# EAGLE design ekomigacz (EAGLE 9.3.2)
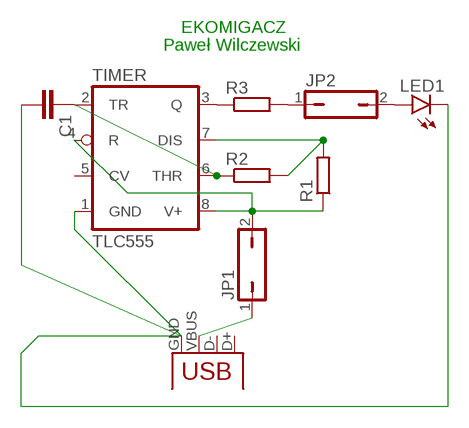
[diagram p0: schematic, sheet 1]

## Parts
C1  C5/3  [C5B3]
JP1  JP1Q  [JP1]
JP2  JP1Q  [JP1]
LED1  LED5MM  [LED5MM]
R1  R-EU_0207/10  [0207/10]
R2  R-EU_0207/10  [0207/10]
R3  R-EU_0207/10  [0207/10]
TIMER  TLC555  NE555N  [DIL08]
X1  USB-A-H  [USB-A-H]

## Nets
5V: R3.1 TIMER.3(Q)
N$1: JP1.1 X1.VBUS
N$2: R1.2 R2.2 TIMER.7(DIS)
N$4: JP1.2 R1.1 TIMER.4(R) TIMER.8(V+)
N$5: C1.1 R2.1 TIMER.2(TR) TIMER.6(THR)
N$6: JP2.1 R3.2
N$7: JP2.2 LED1.A
N$9: C1.2 LED1.K(C) TIMER.1(GND) X1.GND
Unconnected: TIMER.5(CV) X1.D+ X1.D-

## Notes on the sheet
- EKOMIGACZ
- Paweł Wilczewski

## Library data of the parts
C1 = capacitor-wima:C: CAPACITOR naming: grid - package width
JP1 JP2 = jumper:JP1Q: JUMPER
LED1 = led:LED: LED OSRAM: - CHIPLED LG R971, LG N971, LY N971, LG Q971, LY Q971, LO R971, LY R971 LH N974, LH R974 LS Q976, LO Q976, LY Q976 LO Q996 - Hyper CHIPLED LW Q18S LB Q993, LB Q99A, LB R99A - SideLED LS A670, LO A670, LY A670, LG A670, LP A670 LB A673, LV A673, LT A673, LW A673 LH A674 LY A675 LS A676, LA A676, LO A676, LY A676, LW A676 LS A679, LY A679, LG A679 - Hyper Micro SIDELED® LS Y876, LA Y876, LO Y876, LY Y876 LT Y87S - SmartLED LW L88C, LW L88S LB L89C, LB L89S, LG L890 LS L89K, LO L89K, LY L89K LS L896, LA L896, LO L896, LY L896 - TOPLED LS T670, LO T670, LY T670, LG T670, LP T670 LSG T670, LSP T670, LSY T670, LOP T670, LYG T670 LG T671, LOG T671, LSG T671 LB T673, LV T673, LT T673, LW T673 LH T674 LS T676, LA T676, LO T676, LY T676, LB T676, LH T676, LSB T676, LW T676 LB T67C, LV T67C, LT T67C, LS T67K, LO T67K, LY T67K, LW E67C LS E67B, LA E67B, LO E67B, LY E67B, LB E67C, LV E67C, LT E67C LW T67C LS T679, LY T679, LG T679 LS T770, LO T770, LY T770, LG T770, LP T770 LB T773, LV T773, LT T773, LW T773 LH T774 LS E675, LA E675, LY E675, LS T675 LS T776, LA T776, LO T776, LY T776, LB T776 LHGB T686 LT T68C, LB T68C - Hyper Mini TOPLED® LB M676 - Mini TOPLED Santana® LG M470 LS M47K, LO M47K, LY M47K Source: http://www.osram.convergy.de LUXEON: - LUMILED® LXK2-PW12-R00, LXK2-PW12-S00, LXK2-PW14-U00, LXK2-PW14-V00 LXK2-PM12-R00, LXK2-PM12-S00, LXK2-PM14-U00 LXK2-PE12-Q00, LXK2-PE12-R00, LXK2-PE12-S00, LXK2-PE14-T00, LXK2-PE14-U00 LXK2-PB12-K00, LXK2-PB12-L00, LXK2-PB12-M00, LXK2-PB14-N00, LXK2-PB14-P00, LXK2-PB14-Q00 LXK2-PR12-L00, LXK2-PR12-M00, LXK2-PR14-Q00, LXK2-PR14-R00 LXK2-PD12-Q00, LXK2-PD12-R00, LXK2-PD12-S00 LXK2-PH12-R00, LXK2-PH12-S00 LXK2-PL12-P00, LXK2-PL12-Q00, LXK2-PL12-R00 Source: www.luxeon.com KINGBRIGHT: KA-3528ASYC Source: www.kingbright.com
R1-R3 = rcl:R-EU_: RESISTOR, European symbol; SPICEPREFIX: R
TIMER = linear:*555: TIMER; SPICEPREFIX: X
X1 = con-usb:USB: USB Connectors

## Net classes
0 default: width 0.305 mm, drill 0.508 mm, clearance 0.254 mm

## Board
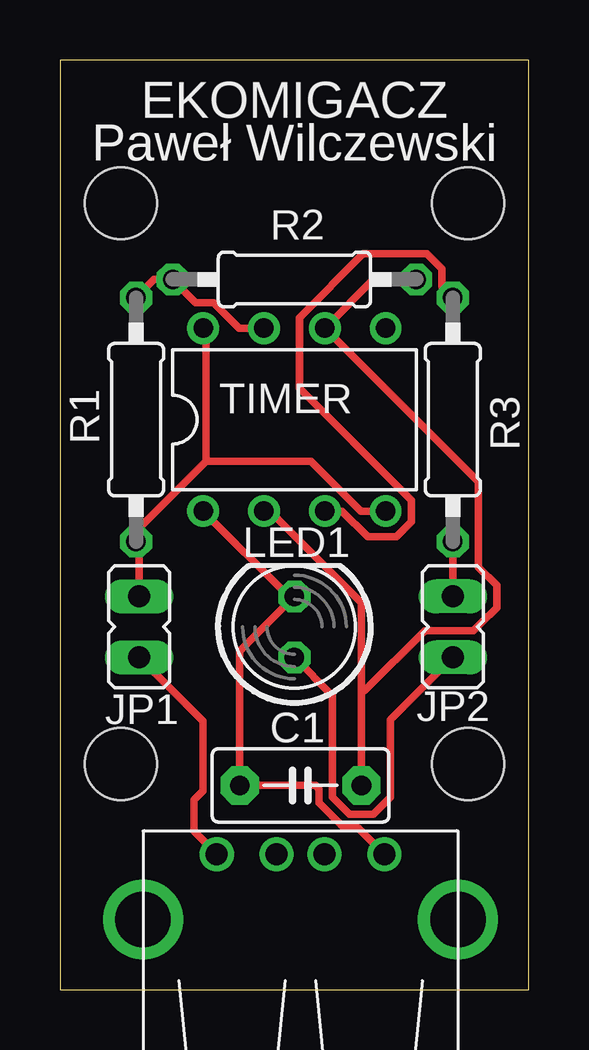
[diagram p1: board, top side]

Size 19.56 x 38.73 mm. Coordinates in mm from the lower left corner, seen from the top.
Outline: 0,0 19.56,0 19.56,38.73 0,38.73 0,0
Copper layers (1*16): Top 0.035mm / dielectric 1.5mm / Bottom 0.035mm
Design rules "default": minimum track width 6mil, minimum drill 0.35mm, track to track 6mil, track to pad 6mil, pad to pad 6mil, via to via 6mil, smd to smd 6mil, copper to edge 40mil, drill to drill 6mil, minimum pad ring 10mil, minimum via ring 8mil, stop-mask expansion 4mil, vias tented up to drill 0mil, thermal gap 10mil
Holes 3 mm at 2.54,9.4 17.02,9.4 17.02,32.77 2.54,32.77

### Footprints (pad centres in the part's own frame; a part is rotated, then mirrored left to right if it is on the bottom)
C5B3 = drill 0.813 pad 1.6 octagon: 1 -2.54,0; 2 2.54,0
JP1 = drill 0.914 long: 1 0,-1.27; 2 0,1.27
LED5MM = drill 0.813 octagon: A -1.27,0; K 1.27,0
0207/10 = drill 0.813 octagon: 1 -5.08,0; 2 5.08,0
DIL08 = drill 0.813 pad 1.27: 1 -3.81,-3.81; 2 -1.27,-3.81; 3 1.27,-3.81; 4 3.81,-3.81; 5 3.81,3.81; 6 1.27,3.81; 7 -1.27,3.81; 8 -3.81,3.81
USB-A-H = drill 0.914: D+ 2.718,-1.003; D- 2.718,1.003; GND 2.718,-3.493; VBUS 2.718,3.493 | drill 2.311: P$5 0,-6.566; P$6 0,6.566

### Placement (x,y rotation side)
C1  10.03,8.51 180 top
JP1  3.3,15.11 0 top
JP2  16.38,15.11 180 top
LED1  9.78,15.11 90 top
R1  3.17,23.75 90 top
R2  9.78,29.59 180 top
R3  16.38,23.75 270 top
TIMER  9.78,23.75 0 top
X1  10.03,2.92 90 top

### Tracks (layer width: path | path; a pad name or v marks a point on that pad's centre or on a via)
5V
  Top 0.305: TIMER.3 11.77,19.94 12.83,18.87 14.03,18.87 14.66,19.5 14.66,20.38 9.98,25.05 9.98,28 12.64,30.66 15.3,30.66 15.93,30.03 15.93,29.29 R3.1
N$1
  Top 0.305: X1.VBUS 5.59,6.59 5.59,7.91 5.97,8.29 5.97,11.18 JP1.1
N$2
  Top 0.305: R1.2 3.94,29.59 R2.2 5.66,28.63 6.41,28.63 7.48,27.56 TIMER.7
N$4
  Top 0.305: JP1.2 3.3,18.54 R1.1 3.17,19.1 6.1,22.02 | TIMER.4 12.56,19.94 10.47,22.02 6.1,22.02 | TIMER.8 6.1,27.43 6.1,22.02
N$5
  Top 0.305: C1.1 12.57,12.45 | 12.57,12.45 12.57,16.13 8.76,19.94 TIMER.2 | R2.1 13.08,29.59 TIMER.6 17.45,21.16 17.45,17.61 18.21,16.85 18.21,15.92 17.56,15.27 17.55,15.27 17.25,14.96 15.21,14.96 12.69,12.45 12.57,12.45
N$6
  Top 0.305: JP2.1 R3.2
N$7
  Top 0.305: JP2.2 13.78,11.24 13.78,8.01 13.07,7.3 12.07,7.3 11.37,8.01 11.37,12.26 LED1.A
N$9
  Top 0.305: TIMER.1 9.53,16.38 LED1.K 7.49,14.1 C1.2 10.65,8.51 10.81,8.36 10.81,7.78 11.84,6.74 12.42,6.74 X1.GND

### Text on the board
tNames: EKOMIGACZ | Paweł Wilczewski